# EAGLE design ArduinoInterface_v2 (EAGLE 9.2.1)
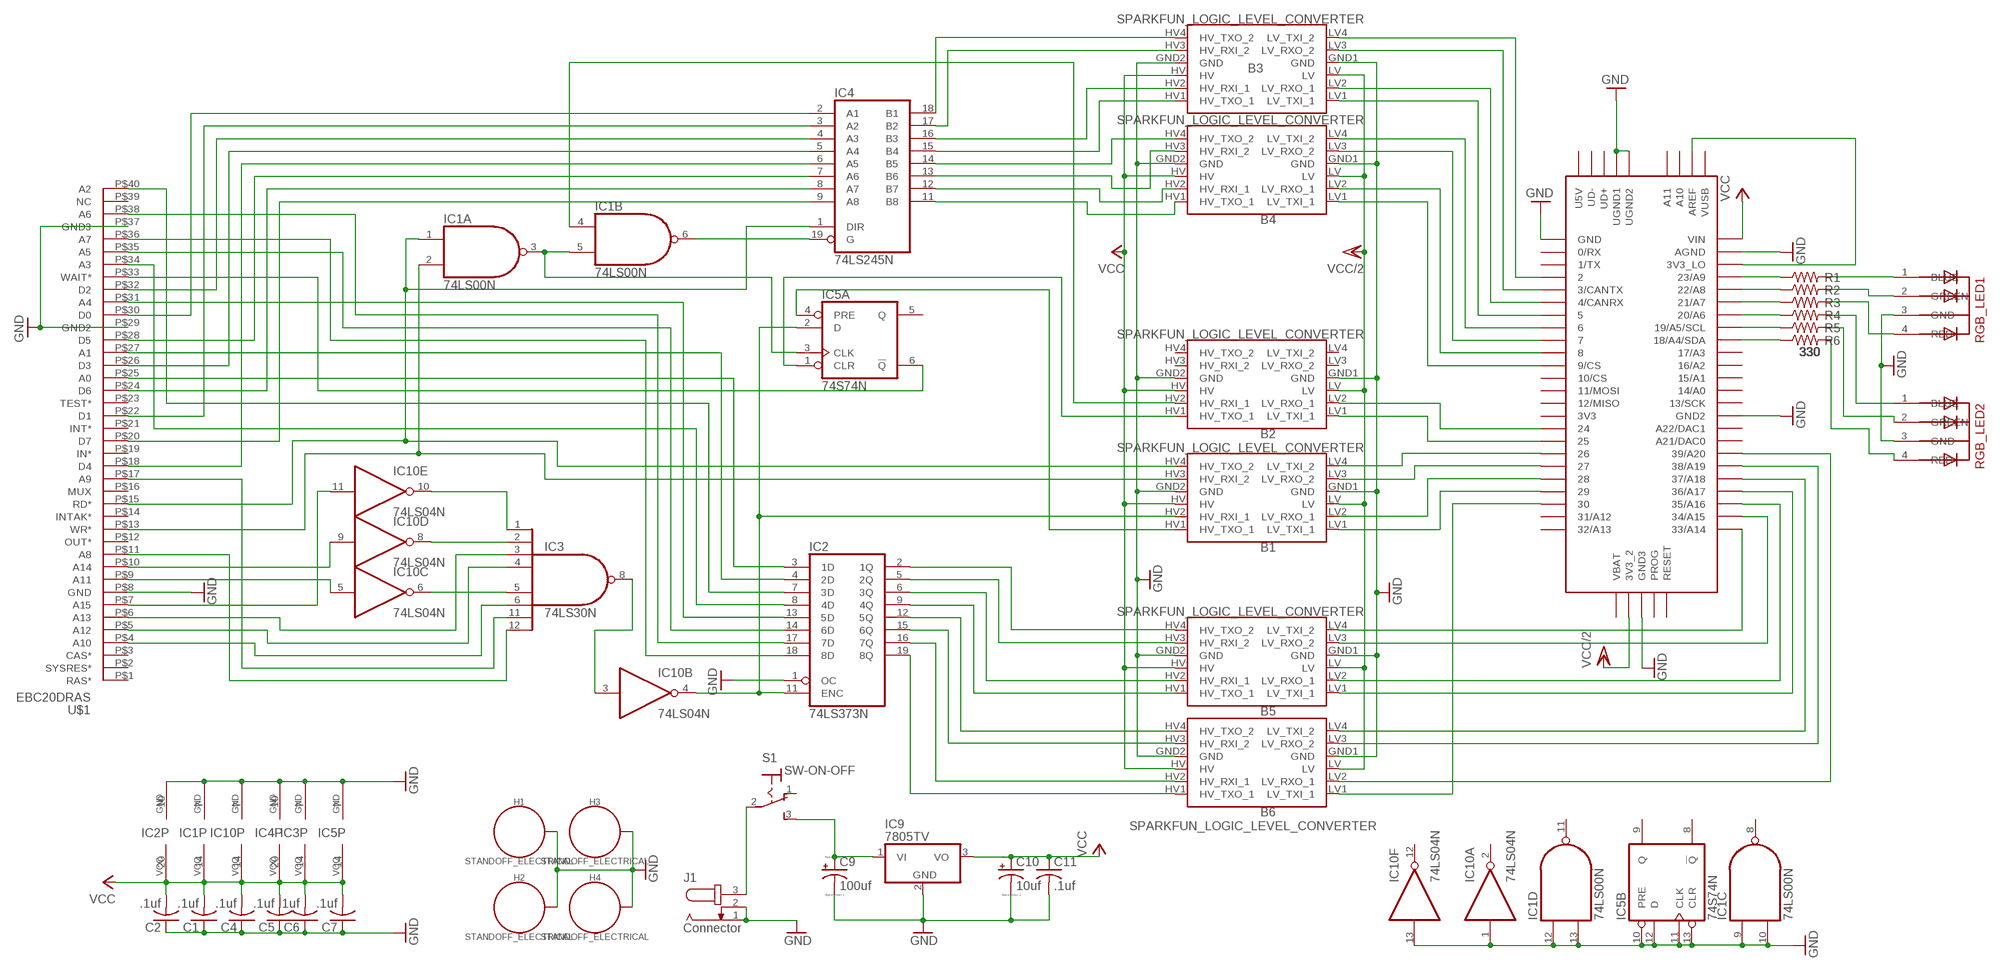
[diagram p0: schematic, sheet 1]

## Parts
B1  SPARKFUN_LOGIC_LEVEL_CONVERTER  [SPARKFUN_LOGIC_LEVEL_CONVERTER]
B2  SPARKFUN_LOGIC_LEVEL_CONVERTER  [SPARKFUN_LOGIC_LEVEL_CONVERTER]
B3  SPARKFUN_LOGIC_LEVEL_CONVERTER  [SPARKFUN_LOGIC_LEVEL_CONVERTER]
B4  SPARKFUN_LOGIC_LEVEL_CONVERTER  [SPARKFUN_LOGIC_LEVEL_CONVERTER]
B5  SPARKFUN_LOGIC_LEVEL_CONVERTER  [SPARKFUN_LOGIC_LEVEL_CONVERTER]
B6  SPARKFUN_LOGIC_LEVEL_CONVERTER  [SPARKFUN_LOGIC_LEVEL_CONVERTER]
C1  .1uf  C-US025-025X050  [C025-025X050]
C2  .1uf  C-US025-025X050  [C025-025X050]
C4  .1uf  C-US025-025X050  [C025-025X050]
C5  .1uf  C-US025-025X050  [C025-025X050]
C6  .1uf  C-US025-025X050  [C025-025X050]
C7  .1uf  C-US025-025X050  [C025-025X050]
C9  100uf  CPOL-USE5-6  [E5-6]
C10  10uf  CPOL-USE5-6  [E5-6]
C11  .1uf  C-US025-025X050  [C025-025X050]
H1  STANDOFF_ELECTRICAL  [STANDOFF-ELECTRICAL]
H2  STANDOFF_ELECTRICAL  [STANDOFF-ELECTRICAL]
H3  STANDOFF_ELECTRICAL  [STANDOFF-ELECTRICAL]
H4  STANDOFF_ELECTRICAL  [STANDOFF-ELECTRICAL]
IC1  74LS00N  [DIL14]
IC2  74LS373N  [DIL20]
IC3  74LS30N  [DIL14]
IC4  74LS245N  [DIL20]
IC5  74S74N  [DIL14]
IC9  7805TV  [TO220V]
IC10  74LS04N  [DIL14]
J1  Connector  JACK-PLUG0  [SPC4077]
R1  330  R-US_0204/2V  [0204V]
R2  330  R-US_0204/2V  [0204V]
R3  330  R-US_0204/2V  [0204V]
R4  330  R-US_0204/2V  [0204V]
R5  330  R-US_0204/2V  [0204V]
R6  330  R-US_0204/2V  [0204V]
RGB_LED1  5MMRGBLED  [LED5MMRGB]
RGB_LED2  5MMRGBLED  [LED5MMRGB]
S1  SW-ON-OFF  M9040P  [M9040P]
U$1  EBC20DRAS  [EBC20DRAS]
U$2  TEENSY_3.5/3.6  [TEENSY_3.5/3.6]

## Nets
A0: IC2.3(1D) U$1.P$25(A0)
A0_AFTER_LATCH: B5.HV4(HV_TXO_2) IC2.2(1Q)
A0_LV: B5.LV4(LV_TXI_2) U$2.33/A14
A1: IC2.4(2D) U$1.P$27(A1)
A1_AFTER_LATCH: B5.HV3(HV_RXI_2) IC2.5(2Q)
A1_LV: B5.LV3(LV_RXO_2) U$2.34/A15
A2: IC2.7(3D) U$1.P$40(A2)
A2_AFTER_LATCH: B5.HV2(HV_RXI_1) IC2.6(3Q)
A2_LV: B5.LV2(LV_RXO_1) U$2.35/A16
A3: IC2.8(4D) U$1.P$34(A3)
A3_AFTER_LATCH: B5.HV1(HV_TXO_1) IC2.9(4Q)
A3_LV: B5.LV1(LV_TXI_1) U$2.36/A17
A4: IC2.13(5D) U$1.P$31(A4)
A4_AFTER_LATCH: B6.HV4(HV_TXO_2) IC2.12(5Q)
A4_LV: B6.LV4(LV_TXI_2) U$2.37/A18
A5: IC2.14(6D) U$1.P$35(A5)
A5_AFTER_LATCH: B6.HV3(HV_RXI_2) IC2.15(6Q)
A5_LV: B6.LV3(LV_RXO_2) U$2.38/A19
A6: IC2.17(7D) U$1.P$38(A6)
A6_AFTER_LATCH: B6.HV2(HV_RXI_1) IC2.16(7Q)
A6_LV: B6.LV2(LV_RXO_1) U$2.39/A20
A7: IC2.18(8D) U$1.P$36(A7)
A7_AFTER_LATCH: B6.HV1(HV_TXO_1) IC2.19(8Q)
A7_LV: B6.LV1(LV_TXI_1) U$2.30
A8: IC3.12(I7) U$1.P$11(A8)
A9: IC3.11(I6) U$1.P$17(A9)
A10: IC3.6(I5) U$1.P$4(A10)
A11: IC10.5(C:I) U$1.P$9(A11)
A12: IC3.4(I3) U$1.P$5(A12)
A13: IC3.3(I2) U$1.P$6(A13)
A15: IC10.11(E:I) U$1.P$7(A15)
D0: IC4.2(A1) U$1.P$30(D0)
D0_HV: B3.HV4(HV_TXO_2) IC4.18(B1)
D0_LV: B3.LV4(LV_TXI_2) U$2.2
D1: IC4.3(A2) U$1.P$22(D1)
D1_HV: B3.HV3(HV_RXI_2) IC4.17(B2)
D1_LV: B3.LV3(LV_RXO_2) U$2.3/CANTX
D2: IC4.4(A3) U$1.P$32(D2)
D2_HV: B3.HV2(HV_RXI_1) IC4.16(B3)
D2_LV: B3.LV2(LV_RXO_1) U$2.4/CANRX
D3: IC4.5(A4) U$1.P$26(D3)
D3_HV: B3.HV1(HV_TXO_1) IC4.15(B4)
D3_LV: B3.LV1(LV_TXI_1) U$2.5
D4: IC4.6(A5) U$1.P$18(D4)
D4_HV: B4.HV4(HV_TXO_2) IC4.14(B5)
D4_LV: B4.LV4(LV_TXI_2) U$2.6
D5: IC4.7(A6) U$1.P$28(D5)
D5_HV: B4.HV3(HV_RXI_2) IC4.13(B6)
D5_LV: B4.LV3(LV_RXO_2) U$2.7
D6: IC4.8(A7) U$1.P$24(D6)
D6_HV: B4.HV2(HV_RXI_1) IC4.12(B7)
D6_LV: B4.LV2(LV_RXO_1) U$2.8
D7: IC4.9(A8) U$1.P$20(D7)
D7_HV: B4.HV1(HV_TXO_1) IC4.11(B8)
D7_LV: B4.LV1(LV_TXI_1) U$2.9/CS
DATA_BUS_ENABLE: B2.HV2(HV_RXI_1) IC1.4(B:I0)
DATA_BUS_ENABLE_LV: B2.LV2(LV_RXO_1) U$2.24
FLIPFLOP_CLR: B2.HV1(HV_TXO_1) IC5.1(A:CLR)
FLIPFLOP_CLR_LV: B2.LV1(LV_TXI_1) U$2.25
FLIPFLOP_PRE: B1.HV1(HV_TXO_1) IC5.4(A:PRE)
FLIPFLOP_PRE_LV: B1.LV1(LV_TXI_1) U$2.29
GND: B1.GND1(GND) B1.GND2(GND) B2.GND1(GND) B2.GND2(GND) B3.GND1(GND) B3.GND2(GND) B4.GND1(GND) B4.GND2(GND) B5.GND1(GND) B5.GND2(GND) B6.GND1(GND) B6.GND2(GND) C1.1 C2.1 C4.1 C5.1 C6.1 C7.1 C9.- C10.- C11.2 H1.P1 H2.P1 H3.P1 H4.P1 IC1.7(P:GND) IC1.9(C:I0) IC1.10(C:I1) IC1.12(D:I0) IC1.13(D:I1) IC2.1(OC) IC2.10(GND) IC3.7(GND) IC4.10(GND) IC5.7(P:GND) IC5.10(B:PRE) IC5.11(B:CLK) IC5.12(B:D) IC5.13(B:CLR) IC9.2(GND) IC10.1(A:I) IC10.7(P:GND) IC10.13(F:I) J1.1 J1.2 RGB_LED1.3(GND) RGB_LED2.3(GND) U$1.P$8(GND) U$1.P$29(GND2) U$1.P$37(GND3) U$2.AGND U$2.GND U$2.GND2 U$2.GND3 U$2.UGND1 U$2.UGND2
INTERRUPT: B1.HV2(HV_RXI_1) IC2.11(ENC) IC5.2(A:D) IC10.4(B:O)
INTERRUPT_LV: B1.LV2(LV_RXO_1) U$2.28
N$1: U$2.3V3_LO U$2.AREF
N$2: IC10.9(D:I) U$1.P$10(A14)
N$3: IC3.1(I0) IC10.10(E:O)
N$4: IC3.2(I1) IC10.8(D:O)
N$5: R1.1 U$2.23/A9
N$6: R2.1 U$2.22/A8
N$7: IC3.8(O) IC10.3(B:I)
N$8: IC3.5(I4) IC10.6(C:O)
N$9: R3.1 U$2.21/A7
N$10: R1.2 RGB_LED1.1(BLUE)
N$11: IC1.6(B:O) IC4.19(G)
N$12: C9.+ IC9.1(VI) S1.3(S)
N$13: IC1.3(A:O) IC1.5(B:I1) IC5.3(A:CLK)
N$14: R2.2 RGB_LED1.2(GREEN)
N$15: R3.2 RGB_LED1.4(RED)
N$16: R4.1 U$2.20/A6
N$17: R5.1 U$2.19/A5/SCL
N$18: R6.1 U$2.18/A4/SDA
N$19: R4.2 RGB_LED2.1(BLUE)
N$20: R5.2 RGB_LED2.2(GREEN)
N$21: R6.2 RGB_LED2.4(RED)
N$22: J1.3 S1.2(P)
RD_: B1.HV4(HV_TXO_2) IC1.1(A:I0) IC4.1(DIR) U$1.P$15(RD*)
RD_LV_: B1.LV4(LV_TXI_2) U$2.26
VCC: B1.HV B2.HV B3.HV B4.HV B5.HV B6.HV C1.2 C2.2 C4.2 C5.2 C6.2 C7.2 C10.+ C11.1 IC1.14(P:VCC) IC2.20(VCC) IC3.14(VCC) IC4.20(VCC) IC5.14(P:VCC) IC9.3(VO) IC10.14(P:VCC) U$2.VIN
VCC/2: B1.LV B2.LV B3.LV B4.LV B5.LV B6.LV U$2.3V3_2
WAIT_: IC5.6(A:!Q) U$1.P$33(WAIT*)
WR_: B1.HV3(HV_RXI_2) IC1.2(A:I1) U$1.P$13(WR*)
WR_LV_: B1.LV3(LV_RXO_2) U$2.27
Unconnected: B2.HV3(HV_RXI_2) B2.HV4(HV_TXO_2) B2.LV3(LV_RXO_2) B2.LV4(LV_TXI_2) IC1.8(C:O) IC1.11(D:O) IC5.5(A:Q) IC5.8(B:!Q) IC5.9(B:Q) IC10.2(A:O) IC10.12(F:O) S1.1(O) U$1.P$1(RAS*) U$1.P$2(SYSRES*) U$1.P$3(CAS*) U$1.P$12(OUT*) U$1.P$14(INTAK*) U$1.P$16(MUX) U$1.P$19(IN*) U$1.P$21(INT*) U$1.P$23(TEST*) U$1.P$39(NC) U$2.0/RX U$2.1/TX U$2.3V3 U$2.10/CS U$2.11/MOSI U$2.12/MISO U$2.13/SCK U$2.14/A0 U$2.15/A1 U$2.16/A2 U$2.17/A3 U$2.21/DAC0(A21/DAC0) U$2.31/A12 U$2.32/A13 U$2.A10 U$2.A11 U$2.A22/DAC1 U$2.PROG U$2.RESET U$2.U5V U$2.UD+ U$2.UD- U$2.VBAT U$2.VUSB

## Library data of the parts
B1-B6 = SparkFun-Boards:SPARKFUN_LOGIC_LEVEL_CONVERTER: SparkFun Logic Level Converter -Bi-Directional This is the mechnical outline for the 3.3V - 5V bi directional logic level converter. *Note, the "LOCK" Package has the header pins staggered by an offset of 5 mils (off center line), so that when you slide a row of standard 0.1" headers into the PTH pads, it will hold position vertically. See the follwing turorial for more information on this type of special footprints: Sneaky Footprints <https://www.sparkfun.com/tutorials/114> SparkFun Products: SparkFun Logic Level Converter - Bi-Directional <https://www.sparkfun.com/products/12009>
C1 C2 C4-C7 C11 = adafruit:C-US: CAPACITOR, American symbol
C9 C10 = resistor:CPOL-US: POLARIZED CAPACITOR, American symbol
H1-H4 = SparkFun-Hardware:STANDOFF_ELECTRICAL: Stand Off Drill holes with an electrical connection. For example, use these to ground your board to a chassis. Example SparkFun Products Screw - Phillips Head (1/4", 4-40, 10 pack) <https://www.sparkfun.com/products/10453> (PRT-10453) Screw - Phillips Head (1/2", 4-40, 10 pack) <https://www.sparkfun.com/products/10452> (PRT-10452) Screw - Phillips Head (3/4", 4-40, 10 pack) <https://www.sparkfun.com/products/10451> (PRT-10451) Screw - Phillips Head (1", 4-40, 10 pack) <https://www.sparkfun.com/products/10450> (PRT-10450)
IC1 = 74xx-us:74*00: Quad 2-input NAND gate
IC2 = 74xx-us:74*373: Octal D type transparent LATCH, edge triggered
IC3 = 74xx-us:74*30: 8-input NAND gate
IC4 = 74xx-us:74*245: Octal BUS TRANSCEIVER, 3-state
IC5 = 74xx-us:74*74: Dual D type positive edge triggered FLIP FLOP, preset and clear
IC9 = linear:78*: Positive VOLTAGE REGULATOR Source: http://cache.national.com/ds/LM/LM78L05.pdf http://www.fairchildsemi.com/ds/LM/LM7805.pdf
IC10 = 74xx-us:74*04: Hex INVERTER
J1 = con-jack:JACK-PLUG: DC POWER JACK Power Jack, DC, Right Angle, Through Hole, Rated 5A at 16VDC, PC Terminals Distributor: Farnell (www.Farnell.de) Drawing: 84N1161.pdf / 84N1162.pdf Manufacturer: SPC Technology (www.spctechnology.com) Type: SPC4077 / SPC 4078; OC_FARNELL: unknown; OC_NEWARK: unknown
R1-R6 = resistor:R-US_: RESISTOR, American symbol
RGB_LED1 RGB_LED2 = adafruit:5MMRGBLED
S1 = switch:M9040P: TOGGLE SWITCH Marquardt
U$1 = TMS99:EBC20DRAS
U$2 = Teensy356:TEENSY_3.5/3.6

## Net classes
0 default: width 0.3 mm, clearance 0.05 mm

## Board
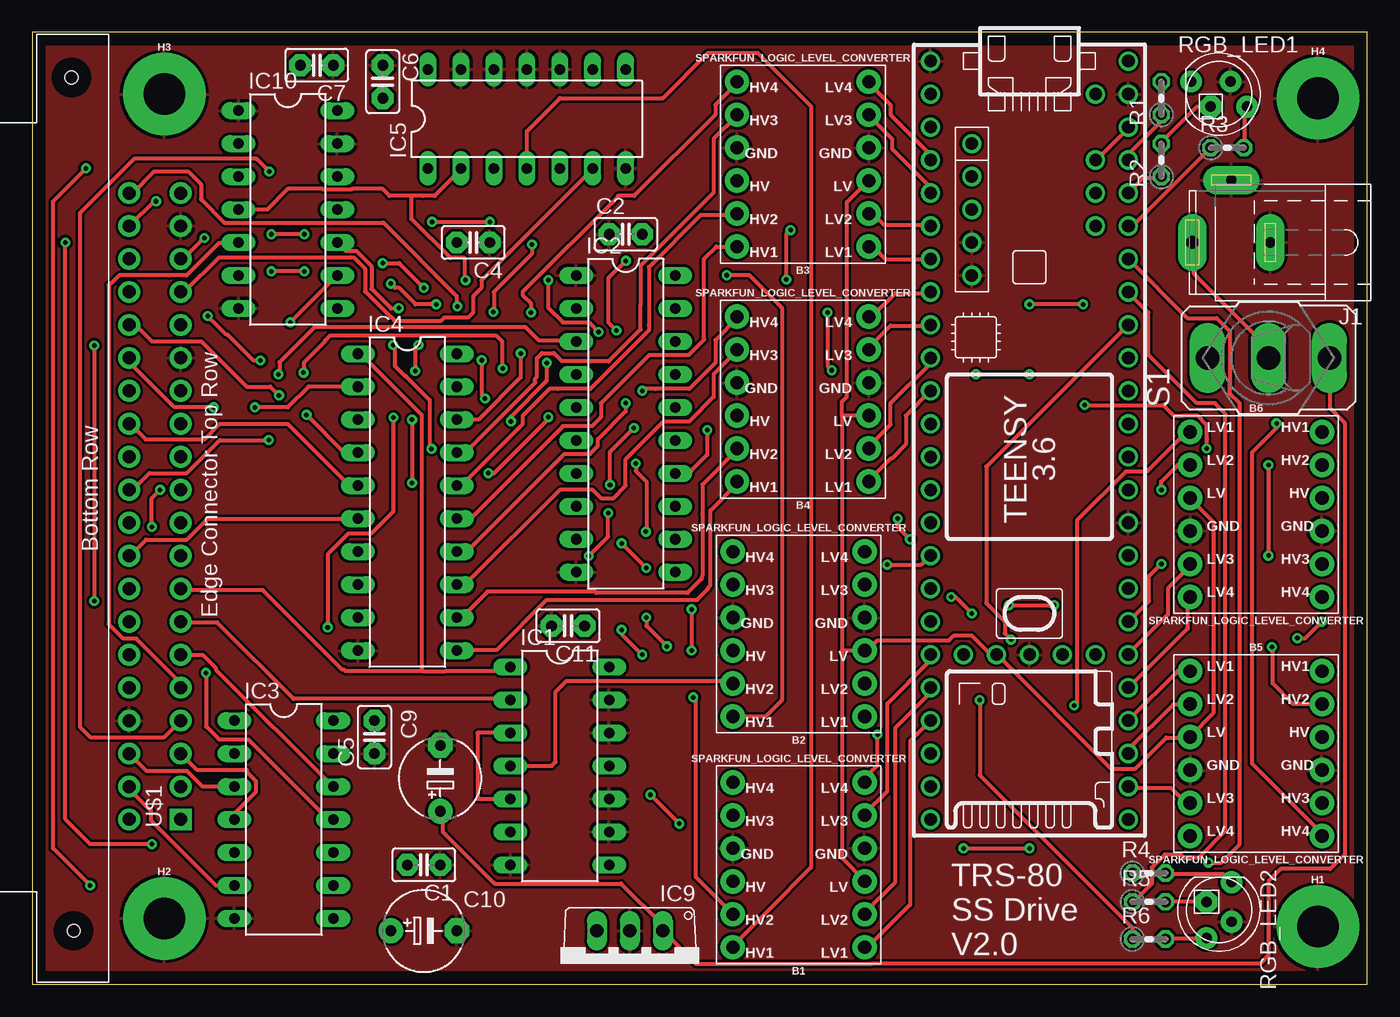
[diagram p1: board, top side]
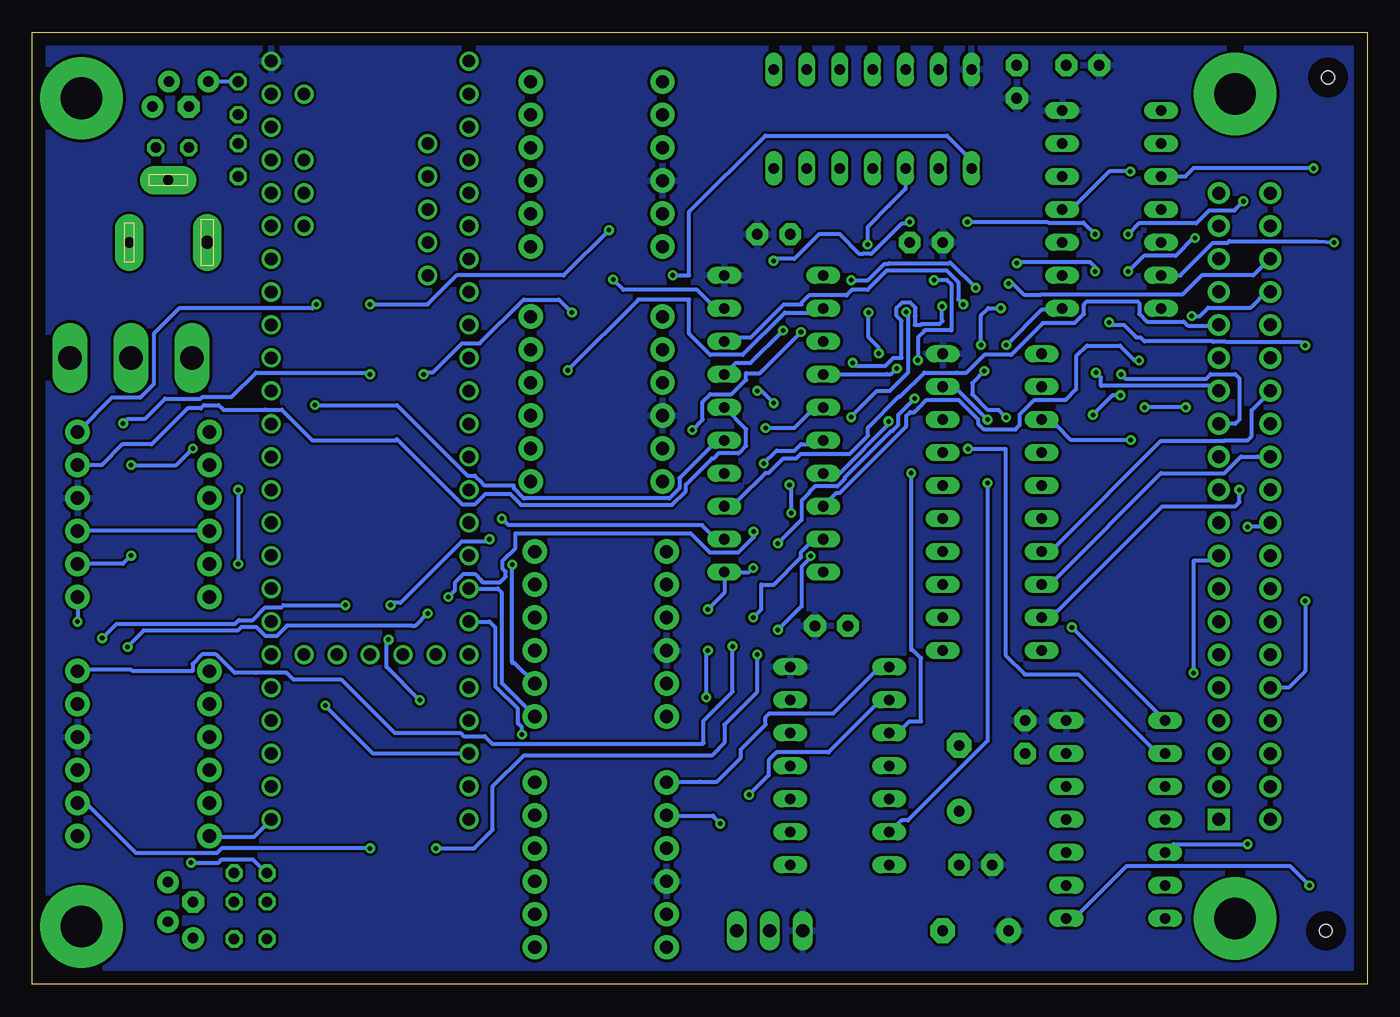
[diagram p2: board, bottom side, seen from below]

Size 102.85 x 73.33 mm. Coordinates in mm from the lower left corner, seen from the top.
Outline: 0,0 102.85,0 102.85,73.33 0,73.33 0,0
Copper layers (1*16): Top 0.035mm / dielectric 1.5mm / Bottom 0.035mm
Design rules "default": minimum track width 0.2mm, minimum drill 0.35mm, track to track 8mil, track to pad 8mil, pad to pad 8mil, via to via 8mil, smd to smd 8mil, copper to edge 40mil, drill to drill 6mil, minimum pad ring 10mil, minimum via ring 8mil, stop-mask expansion 4mil, vias tented up to drill 0mil, thermal gap 10mil

### Footprints (pad centres in the part's own frame; a part is rotated, then mirrored left to right if it is on the bottom)
SPARKFUN_LOGIC_LEVEL_CONVERTER = drill 1.016 pad 1.88: GND1 -5.08,-1.27; GND2 5.08,-1.27; HV 5.08,1.27; HV1 5.08,6.35; HV2 5.08,3.81; HV3 5.08,-3.81; HV4 5.08,-6.35; LV -5.08,1.27; LV1 -5.08,6.35; LV2 -5.08,3.81; LV3 -5.08,-3.81; LV4 -5.08,-6.35
C025-025X050 = drill 0.813 pad 1.676 octagon: 1 -1.27,0; 2 1.27,0
E5-6 = drill 0.813 pad 1.905: + -2.54,0 | drill 0.813 pad 1.905 octagon: - 2.54,0
STANDOFF-ELECTRICAL = drill 3.2 pad 6.35: P1 0,0
DIL14 = drill 0.813 long: 1 -7.62,-3.81; 2 -5.08,-3.81; 3 -2.54,-3.81; 4 0,-3.81; 5 2.54,-3.81; 6 5.08,-3.81; 7 7.62,-3.81; 8 7.62,3.81; 9 5.08,3.81; 10 2.54,3.81; 11 0,3.81; 12 -2.54,3.81; 13 -5.08,3.81; 14 -7.62,3.81
DIL20 = drill 0.813 long: 1 -11.43,-3.81; 2 -8.89,-3.81; 3 -6.35,-3.81; 4 -3.81,-3.81; 5 -1.27,-3.81; 6 1.27,-3.81; 7 3.81,-3.81; 8 6.35,-3.81; 9 8.89,-3.81; 10 11.43,-3.81; 11 11.43,3.81; 12 8.89,3.81; 13 6.35,3.81; 14 3.81,3.81; 15 1.27,3.81; 16 -1.27,3.81; 17 -3.81,3.81; 18 -6.35,3.81; 19 -8.89,3.81; 20 -11.43,3.81
TO220V = drill 1.016 long: 1 -2.54,-2.54; 2 0,-2.54; 3 2.54,-2.54
SPC4077 = drill 0.8 pad 2.184 long: 1 -3,0; 2 0,-4.8 | drill 1 pad 2.184 long: 3 3,0
0204V = drill 0.813 octagon: 1 -1.27,0; 2 1.27,0
LED5MMRGB = drill 0.8 pad 1.676: 1 -2.159,0.968; 3 0.889,0.968; 4 2.159,-0.968 | drill 0.8 pad 1.676 octagon: 2 -0.635,-0.968
M9040P = drill 1.803 long: 1 0,4.699; 2 0,0; 3 0,-4.699
EBC20DRAS = drill 1 pad 1.676 square: P$1 0,0 | drill 1 pad 1.676: P$2 0,3.969; P$3 2.54,0; P$4 2.54,3.969; P$5 5.08,0; P$6 5.08,3.969; P$7 7.62,0; P$8 7.62,3.969; P$9 10.16,0; P$10 10.16,3.969; P$11 12.7,0; P$12 12.7,3.969; P$13 15.24,0; P$14 15.24,3.969; P$15 17.78,0; P$16 17.78,3.969; P$17 20.32,0; P$18 20.32,3.969; P$19 22.86,0; P$20 22.86,3.969; P$21 25.4,0; P$22 25.4,3.969; P$23 27.94,0; P$24 27.94,3.969; P$25 30.48,0; P$26 30.48,3.969; P$27 33.02,0; P$28 33.02,3.969; P$29 35.56,0; P$30 35.56,3.969; P$31 38.1,0; P$32 38.1,3.969; P$33 40.64,0; P$34 40.64,3.969; P$35 43.18,0; P$36 43.18,3.969; P$37 45.72,0; P$38 45.72,3.969; P$39 48.26,0; P$40 48.26,3.969 | hole 1: -8.572,8.255; 57.15,8.414
TEENSY_3.5/3.6 = drill 0.965: 0/RX -25.4,-7.62; 1/TX -22.86,-7.62; 2 -20.32,-7.62; 3/CANTX -17.78,-7.62; 3V3 7.62,-7.62; 3V3_2 17.78,-2.54; 3V3_LO -22.86,7.62; 4/CANRX -15.24,-7.62; 5 -12.7,-7.62; 6 -10.16,-7.62; 7 -7.62,-7.62; 8 -5.08,-7.62; 9/CS -2.54,-7.62; 10/CS 0,-7.62; 11/MOSI 2.54,-7.62; 12/MISO 5.08,-7.62; 13/SCK 5.08,7.62; 14/A0 2.54,7.62; 15/A1 0,7.62; 16/A2 -2.54,7.62; 17/A3 -5.08,7.62; 18/A4/SDA -7.62,7.62; 19/A5/SCL -10.16,7.62; 20/A6 -12.7,7.62; 21/A7 -15.24,7.62; 21/DAC0 12.7,7.62; 22/A8 -17.78,7.62; 23/A9 -20.32,7.62; 24 10.16,-7.62; 25 12.7,-7.62; 26 15.24,-7.62; 27 17.78,-7.62; 28 20.32,-7.62; 29 22.86,-7.62; 30 25.4,-7.62; 31/A12 27.94,-7.62; 32/A13 30.48,-7.62; 33/A14 30.48,7.62; 34/A15 27.94,7.62; 35/A16 25.4,7.62; 36/A17 22.86,7.62; 37/A18 20.32,7.62; 38/A19 17.78,7.62; 39/A20 15.24,7.62; A10 -17.78,5.08; A11 -15.24,5.08; A22/DAC1 10.16,7.62; AGND -25.4,7.62; AREF -20.32,5.08; GND -27.94,-7.62; GND2 7.62,7.62; GND3 17.78,0; PROG 17.78,2.54; RESET 17.78,5.08; U5V -21.59,-4.445; UD+ -16.51,-4.445; UD- -19.05,-4.445; UGND1 -13.97,-4.445; UGND2 -11.43,-4.445; VBAT 17.78,-5.08; VIN -27.94,7.62; VUSB -25.4,5.08

### Placement (x,y rotation side)
B1  59.05,9.21 180 top
B2  59.05,26.99 180 top
B3  59.37,63.18 180 top
B4  59.37,45.09 180 top
B5  94.3,17.78 0 top
B6  94.3,36.2 0 top
C1  30.16,9.21 180 top
C2  45.72,57.78 0 top
C4  33.97,57.15 180 top
C5  26.35,19.05 90 top
C6  26.99,69.53 270 top
C7  21.91,70.8 180 top
C9  31.43,15.88 90 top
C10  30.16,4.13 0 top
C11  41.27,27.62 180 top
H1  99.06,4.45 0 top
H2  10.16,5.08 0 top
H3  10.16,68.58 0 top
H4  99.06,68.26 0 top
IC1  40.64,16.83 270 top
IC2  45.72,43.18 270 top
IC3  19.37,12.7 270 top
IC4  28.89,37.15 270 top
IC5  38.1,66.67 0 top
IC9  46.04,1.59 180 top
IC10  19.68,59.69 270 top
J1  92.39,57.15 180 top
R1  87,68.26 90 top
R2  87,63.5 90 top
R3  92.08,64.45 0 top
R4  86.04,8.57 0 top
R5  86.04,6.35 0 top
R6  86.04,3.49 0 top
RGB_LED1  91.44,68.58 0 top
RGB_LED2  91.44,5.71 270 top
S1  95.25,48.26 90 top
U$1  11.43,12.7 90 top
U$2  76.83,43.18 270 top

### Tracks (layer width: path | path; a pad name or v marks a point on that pad's centre or on a via)
A0  (via drill 0.35)
  Top 0.3: 38,50.62 39,49.62 41.88,49.62 IC2.3
  Top 0.305: 38,50.62 21.73,50.62 19.05,47.94 19.05,47.09 v18.95,46.99
  Bottom 0.3: v18.95,46.99 18.58,46.61 12.44,46.61 12.05,47 10.17,47 9.84,46.67 9.84,43.5 10.16,43.18 U$1.P$25
A0_AFTER_LATCH  (via drill 0.35)
  Top 0.3: 94.06,16.94 99.5,11.5 B5.HV4 | v72.71,46.99 v76.83,46.99
  Top 0.305: v61.28,51.75 61.28,47.62 v61.59,47.31 | v95.86,43.22 95.86,42.84 93.98,40.96 93.98,17.02 94.06,16.94
  Bottom 0.3: 52.25,52.75 52.25,50.12 50.62,48.5 48.12,48.5 44.88,51.75 42.25,51.75 42,52 IC2.2 | 65,52.75 68.38,49.38 69.75,49.38 72,47.12 72.57,47.12 v72.71,46.99 | 89.88,45.12 89.75,45.25 87.5,45.25 85.62,47.12 76.97,47.12 v76.83,46.99
  Bottom 0.305: 52.25,52.75 56.15,52.75 v61.59,47.31 | 65,52.75 62.27,52.75 v61.28,51.75 | 89.88,45.12 92.63,45.12 94.22,43.54 95.54,43.54 v95.86,43.22
A0_LV
  Bottom 0.3: U$2.33/A14 84.5,12.62 85.75,11.38 89.12,11.38 B5.LV4
A1  (via drill 0.35)
  Top 0.3: 22.96,50 33.97,50
  Top 0.305: v20.89,47.12 20.95,47.19 20.95,47.94 22.54,49.53 22.54,49.58 22.96,50 | v36.24,47.44 36.2,47.49 36.2,49.53 35.73,50 33.97,50
  Bottom 0.3: 37,47 41.88,47 IC2.4 | U$1.P$27 11.6,45.72 11.98,46.11
  Bottom 0.305: 11.98,46.11 20.51,46.11 20.51,46.74 v20.89,47.12 | 37,47 36.68,47 v36.24,47.44
A1_AFTER_LATCH  (via drill 0.35)
  Top 0.3: v44.38,36.31 44.38,34.5 v42.88,33 | v44.51,38.48 44.51,41.02 v46.35,42.86
  Top 0.305: v45.4,27.3 45.4,26.99 v46.99,25.4 | v71.75,10.48 v76.83,10.48
  Bottom 0.3: 50.5,17.62 65,17.62 67.38,15.25 | 88.38,10.38 88.62,10.12 94.88,10.12 98.62,13.88 99.38,13.88 B5.HV3 | v46.35,42.86 44.13,42.86 42.55,44.45 IC2.5
  Bottom 0.305: v42.88,33 42.88,32.88 43.59,32.17 43.59,29.12 v45.4,27.3 | 50.5,17.62 49.53,18.59 49.53,20 46.99,22.54 v46.99,25.4 | 67.38,15.25 67.38,11.91 68.81,10.48 v71.75,10.48 | v44.38,36.31 44.38,38.34 v44.51,38.48 | v76.83,10.48 88.27,10.48 88.38,10.38
A1_LV
  Top 0.3: U$2.34/A15 84.5,15.12 87.75,15.12 88.88,14 89.12,14 B5.LV3
A2  (via drill 0.35)
  Top 0.3: v36.88,43.38 36.88,43.74 39.63,46.5 v39.63,47.88 | 13,61.62 12,62.62 9.38,62.62 7.75,61 7.5,61 U$1.P$40
  Top 0.305: 13,61.62 13,60.47 14.79,58.67 27.05,58.67 32.7,53.02 32.7,52.28 v32.75,52.23
  Bottom 0.3: 41.88,39.38 IC2.7 | v32.75,52.23 32.75,51.16 32.7,51.12 32.94,50.88 34.33,50.88 34.41,50.8 34.84,50.8 34.84,51.44 34.79,51.49 34.79,52.1 35.22,52.53 | 36.83,47.94 36.51,48.26 35.88,48.26 35.88,51.12 36.25,51.49 36.25,52.1 35.99,52.37
  Bottom 0.305: v36.88,43.38 36.88,43.13 40.64,39.37 41.87,39.37 41.88,39.38 | 36.83,47.94 37.15,47.62 39.38,47.62 v39.63,47.88 | 35.22,52.53 35.82,52.53 35.99,52.37
A2_AFTER_LATCH  (via drill 0.35)
  Top 0.305: v70.8,29.84 71.12,29.84 v72.39,28.57 | v46.5,40.12 46.5,39.54 47.31,38.73 47.31,34.9 v47.28,34.87 | B5.HV2 97.16,21.59 95.57,23.18 95.57,25.94 v95.52,25.99
  Bottom 0.3: v46.5,40.12 45.5,41.12 44.12,41.12 43.62,41.62 42.25,41.62 42,41.88 IC2.6 | 48.47,33.25 50.62,33.25 52.12,34.75 65.62,34.75 65.62,33.61 66.61,32.63 66.61,32.03 66.38,31.8 66.38,31.41 66.8,30.99 68.18,30.99 68.26,31.07 68.26,31.14 68.75,31.62 | 73.62,27.62 82.25,27.62
  Bottom 0.305: v70.8,29.84 70.31,30.34 70.31,30.93 69.61,31.62 68.75,31.62 | 73.62,27.62 73.34,27.62 v72.39,28.57 | v47.28,34.87 47.28,34.44 48.47,33.25 | 82.25,27.62 83.22,27.62 84,26.85 84.91,26.85 85.6,27.54 86.74,27.54 87.04,27.24 94.3,27.24 94.3,27.21 v95.52,25.99
A2_LV
  Top 0.305: U$2.35/A16 84.45,18.1 87.95,21.59 B5.LV2
A3  (via drill 0.35)
  Top 0.305: v17.57,48.06 17.04,48.06 15.04,50.05 14.94,50.05 v13.51,51.48
  Bottom 0.3: 12.25,52.12 8.97,52.12 7.72,53.38 7.5,53.38 U$1.P$34 | 23.18,45.09 23.24,45.02 25.65,45.02 26.76,43.92 26.76,43.09 27.1,42.75 29.53,42.75 29.55,42.77 29.98,43.2 29.98,43.52 31.49,45.02 33.94,45.02 34.57,44.39 34.58,44.39 34.88,44.09 35.2,44.09 35.5,43.79 35.5,42.98 40.62,37.85 40.89,37.85 IC2.8
  Bottom 0.305: v17.57,48.06 17.89,48.06 19.04,49.21 21.59,49.21 22.43,48.38 22.43,45.84 23.18,45.09 | v13.51,51.48 12.89,51.48 12.25,52.12
A3_AFTER_LATCH  (via drill 0.35)
  Top 0.305: v47.31,28.26 47.31,27.62 v48.9,26.04
  Bottom 0.3: 51.22,18.5 67.38,18.5 68,19.12 69.62,19.12 | 82.75,23.5 83.25,24 85.62,24 | 95.25,24.25 99.38,24.25 B5.HV1 | v47.31,28.26 46.67,28.89 46.67,30.8 45.72,30.8 43.61,32.91 43.61,33.3 42.86,34.05 42.86,34.29 IC2.9
  Bottom 0.305: 51.22,18.5 51.12,18.6 51.12,20.32 48.9,22.54 v48.9,26.04 | 85.62,24 87.26,24 88.68,25.43 89.75,25.43 90.51,24.67 90.51,24.13 95.13,24.13 95.25,24.25 | 82.75,23.5 79.06,23.5 74.93,19.37 69.87,19.37 69.62,19.12
A3_LV
  Top 0.3: U$2.36/A17 84.5,20.38 88.25,24.12 89.12,24.12 B5.LV1
A4
  Bottom 0.3: 40.75,40.88 43.62,40.88 44,40.5 45,40.5 46.12,39.38 46.38,39.38 48.5,37.25 49.12,37.25 49.5,36.88 IC2.13 | 38.4,42.97 36.12,45.25 36,45.25 34.12,47.12 31.62,47.12 | 29.5,48.5 27.42,48.5 24.99,50.93 22.54,50.93 21.82,51.65 21.82,52.39 21.59,52.62 17.7,52.62 17.55,52.47 17.55,51.65 16.95,51.06 14.12,51.06 13.81,50.75 11.48,50.75 U$1.P$31
  Bottom 0.305: 31.62,47.12 30.88,47.12 29.5,48.5 | 40.75,40.88 39.85,40.88 38.46,42.27 38.46,42.92 38.4,42.97
A4_AFTER_LATCH  (via drill 0.35)
  Top 0.3: v67.63,34.29 66.67,35.24 v66.67,35.88
  Top 0.305: v97.47,26.67 98.11,26.67 v99.38,27.94 | v75.25,29.21 v78.74,29.21
  Bottom 0.3: 74.38,29.49 69.75,34.12 67.79,34.12 v67.63,34.29 | IC2.12 49.62,34.38 50,34.75 50.62,34.75 51.25,35.38 66.17,35.38 v66.67,35.88
  Bottom 0.305: v97.47,26.67 96.39,27.75 87.25,27.75 86.95,28.05 85.89,28.05 84.91,29.03 83.68,29.03 83.5,29.21 v78.74,29.21 | B6.HV4 v99.38,27.94 | v75.25,29.21 75.06,29.39 74.48,29.39 74.38,29.49
A4_LV
  Top 0.3: U$2.37/A18 84.5,22.88 89,27.38 89,29.62 89.12,29.75 B6.LV4
A5  (via drill 0.35)
  Top 0.3: v52,42.7 52,40.8 50.8,39.6 49.76,39.6 IC2.14 | v43.62,50.25 42.88,51 40.88,51 39.75,52.12 v39.75,54.25 | v13.25,57.5 11.75,56 11.5,56 U$1.P$35
  Top 0.305: v26.99,55.56 28.26,55.56 v30.16,53.66 | v20.95,54.93 v18.41,54.93
  Bottom 0.3: 14.75,56.12 13.38,57.5 v13.25,57.5 | 50.61,45.47 48.96,45.47 47.86,46.57 47.86,47.08 46.8,47.08 v43.62,50.25
  Bottom 0.305: v26.99,55.56 26.92,55.63 22.41,55.63 22.41,55.62 21.34,55.62 20.95,55.24 v20.95,54.93 | v30.16,53.66 32.13,55.62 32.19,55.56 36.83,55.56 36.88,55.51 37.21,55.51 38.47,54.25 v39.75,54.25 | 50.61,45.47 51.21,44.87 51.21,43.5 v52,42.7 | 14.75,56.12 17.22,56.12 v18.41,54.93
A5_AFTER_LATCH  (via drill 0.35)
  Top 0.305: v95.25,40.01 v95.25,33.02 | v81.08,44.62 87.14,44.62 87.95,43.81 88.66,43.81 88.68,43.84 89.75,43.84 90.51,43.08 90.51,42.01 90.49,41.98 v90.49,41.27
  Bottom 0.3: 69.62,39.5 74.75,44.62 v81.08,44.62 | IC2.15 49.62,41.88 50,41.5 50.5,41.5 53,39 53,38.2 53.76,37.44 64.99,37.44 65.75,38.2 65.75,38.42 67.99,38.42 68.12,38.55
  Bottom 0.305: v90.49,41.27 91.76,40.01 v95.25,40.01 | v95.25,33.02 95.89,32.38 B6.HV3 | 68.12,38.55 68.76,39.19 69.32,39.19 69.62,39.5
A5_LV
  Top 0.3: U$2.38/A19 84.5,25.5 87.5,28.5 87.5,30.5 89.12,32.12 89.12,32.38 B6.LV3
A6  (via drill 0.35)
  Top 0.3: 44.38,51.32 44.38,51 v45.01,50.37
  Top 0.305: v30.8,58.74 v35.24,58.74 | v20.95,57.78 v18.41,57.78 | v9.53,60.33 9.37,60.33 U$1.P$38 | 44.38,51.32 44.38,54.38 v45.73,55.74
  Bottom 0.3: 48,47.88 48.62,47.88 49.5,47 IC2.17 | 13.16,58.62 12.16,59.62 | 47.82,47.88 47.5,47.88 v45.01,50.37
  Bottom 0.305: v35.24,58.74 35.35,58.62 35.84,58.62 38.2,56.27 38.86,56.27 38.88,56.25 39.1,56.25 40.64,57.78 42.23,57.78 44.13,55.88 45.59,55.88 v45.73,55.74 | v30.8,58.74 24.64,58.74 24.58,58.67 21.84,58.67 v20.95,57.78 | 48,47.88 47.82,47.88 | 13.16,58.62 17.57,58.62 v18.41,57.78 | 12.16,59.62 10.22,59.62 v9.53,60.33
A6_AFTER_LATCH
  Bottom 0.3: 89.88,44.38 89.62,44.62 88.5,44.62 88.12,44.25 84.93,44.25 84.91,44.27 83.64,44.27 81.28,41.91 74.84,41.91 74.75,42 69.75,37 68.73,37 67.94,37.78 66.04,37.78 65.2,36.94 53.55,36.94 52.5,37.99 52.5,38.5 50.5,40.5 50.38,40.5 49.98,40.9 48.45,40.9 48.38,40.97 | IC2.16
  Bottom 0.305: 48.38,40.97 47.85,41.49 47.85,42.77 IC2.16 | B6.HV2 97.51,40.01 95.92,41.59 93.66,41.59 90.88,44.38 89.88,44.38
A6_LV  (via drill 0.35)
  Top 0.305: U$2.39/A20 86.04,29.53 86.04,31.43 v87,32.38 | v87,38.1 87,38.73 88.27,40.01 B6.LV2
  Bottom 0.305: v87,38.1 v87,32.38
A7  (via drill 0.35)
  Top 0.305: v31.11,52.39 29.53,52.39 28.26,53.66 27.94,53.66 v27.62,53.98
  Bottom 0.3: 37,55 38.5,53.5 39.69,53.5 40.1,53.08 42.99,53.08 43.58,52.49 43.58,52.39 44.95,52.39 47.49,49.85 49.21,49.85 IC2.18 | 25.12,53.12 14.25,53.12 12.75,54.62 8.78,54.62 7.48,55.93 U$1.P$36
  Bottom 0.305: v31.11,52.39 31.49,52.77 31.49,54.08 32.41,55 37,55 | 25.12,53.12 26.45,53.12 27.3,53.98 v27.62,53.98
A7_AFTER_LATCH  (via drill 0.35)
  Top 0.305: v80.96,52.39 v76.83,52.39 | v58.1,54.29 58.1,57.78 v58.42,58.1
  Bottom 0.3: 51.62,53.5 50.62,52.5 50,52.5 49.62,52.12 IC2.19 | 91.61,52.01 93.5,50.12
  Bottom 0.305: v80.96,52.39 81.28,52.07 91.56,52.07 91.61,52.01 | 51.62,53.5 57.31,53.5 v58.1,54.29 | v58.42,58.1 61.91,54.61 70.17,54.61 72.39,52.39 v76.83,52.39 | B6.HV1 96.72,45.2 94.54,45.2 93.5,46.24 93.5,50.12
A7_LV  (via drill 0.35)
  Top 0.3: 80.5,24.88 80.5,35.75 84.25,39.5 85.88,39.5 88.88,42.5 89.12,42.5 B6.LV1
  Top 0.305: 80.5,24.88 80.5,21.7 v80.28,21.48
  Bottom 0.305: U$2.30 76.58,17.78 v80.28,21.48
A8
  Top 0.3: IC3.12 23.12,15.25 14.12,24.25 14.12,24.38 13.12,25.38 11.5,25.38 U$1.P$11
A9  (via drill 0.35)
  Top 0.3: v13.38,24 13.38,19.88 14.38,18.88 16.62,18.88 22.75,12.75 23.12,12.75 IC3.11
  Bottom 0.3: v13.38,24 13.38,32.62 11.88,32.62 11.5,33 U$1.P$17
A10
  Top 0.3: IC3.6 15.5,7.62 14.12,7.62 9.12,12.62 9.12,13.38 7.38,15.12 U$1.P$4
A11
  Top 0.3: 10.5,54.62 11.88,54.62 14.38,57.12 15.88,57.12 IC10.5 | 5.88,53.86 5.88,27.75 7,26.62 8,26.62 11.38,23.25 11.38,22.88 U$1.P$9
  Top 0.305: 10.5,54.62 6.68,54.62 6.03,53.98 6.03,54.02 5.88,53.86
A12
  Top 0.305: IC3.4 15.56,13.14 17.23,14.82 17.23,15.66 16.51,16.39 16.51,16.51 12.7,16.51 U$1.P$5
A13
  Top 0.305: IC3.3 13.12,15.24 11.92,16.43 8.81,16.43 U$1.P$6
A15  (via drill 0.35)
  Top 0.3: v18.25,62.62 17.25,63.62 7.88,63.62 3.66,59.41 3.66,27.46
  Top 0.305: 3.66,27.46 3.66,19.83 4.45,19.05 10.16,19.05 U$1.P$7
  Bottom 0.3: v18.25,62.62 19.88,62.62 22.38,60.12 23,60.12 23.38,59.75 IC10.11
D0  (via drill 0.35)
  Top 0.3: 10.88,44.5 7.5,47.88 7.5,48.25 U$1.P$30
  Top 0.305: 10.88,44.5 13.92,44.5 v13.97,44.45 | v17.14,44.45 17.2,44.5 17.25,44.45 19.68,44.45 21.27,46.04 IC4.2
  Bottom 0.305: v13.97,44.45 v17.14,44.45
D0_HV  (via drill 0.35)
  Top 0.3: v37.62,48.6 37.62,46.75 34.38,43.5 32.75,43.5 IC4.18 | 45.12,60.75 46.38,60.75 52.62,67 52.62,67.75 54.38,69.5 B3.HV4 | 37.78,53.34 37.78,53.09 38.42,52.45 v38.42,51.75
  Top 0.305: 45.12,60.75 45.12,60.68 37.78,53.34
  Bottom 0.3: v37.62,48.6 37.62,49.05 38.42,49.85 v38.42,51.75
D0_LV
  Top 0.3: U$2.2 69.12,63.5 69.12,64 66.12,67 66.12,67.75 64.38,69.5 B3.LV4
D1  (via drill 0.35)
  Top 0.3: v18.21,41.93 14.43,41.93 11.88,39.38 9,39.38 7.75,38.12 7.5,38.12 U$1.P$22
  Bottom 0.3: v18.21,41.93 22.81,41.93 23.88,43 24.62,43 25,43.38 IC4.3
D1_HV
  Top 0.3: 38.88,46.82 38.88,48.25 39.26,48.62 40.19,48.62 | 46.88,52.38 46.88,55.38 52.5,61 52.5,65.12 54.25,66.88 B3.HV3
  Top 0.305: 46.88,52.38 46.88,50.47 44.4,47.99 43.01,47.99 42.99,48.01 40.81,48.01 40.19,48.62 | IC4.17 33.34,40.96 38.73,46.35 38.73,46.67 38.88,46.82
D1_LV
  Top 0.3: U$2.3/CANTX 69.12,61 69.12,61.5 66.25,64.38 66.25,65.12 64.5,66.88 B3.LV3
D2  (via drill 0.35)
  Top 0.3: v21.12,43.88 24,41 25,41 IC4.4 | 9.21,49.53 13.02,49.53 16.51,46.04 18.34,46.04 v19,45.38
  Top 0.305: U$1.P$32 7.94,50.8 9.21,49.53
  Bottom 0.3: v21.12,43.88 19.62,45.38 v19,45.38
D2_HV
  Top 0.3: 33.12,38.5 32.75,38.5 IC4.16 | 40.5,45.88 43,45.88 47.5,50.38 47.5,50.8 47.5,55.25 51.5,59.25 54.25,59.25 B3.HV2
  Top 0.305: 40.5,45.88 39.84,45.88 37.78,43.81 37.78,43.16 33.12,38.5
D2_LV
  Top 0.3: U$2.4/CANRX 69.12,58.5 65.62,58.5 64.88,59.25 64.5,59.25 B3.LV2
D3
  Top 0.3: U$1.P$26 7.52,43.18 8.71,41.99 13.26,41.99 14.45,43.18 14.61,43.18
  Top 0.305: IC4.5 24.45,38.42 19.68,43.18 14.61,43.18
D3_HV
  Top 0.3: 43.12,43 40.88,43 33.88,36 32.75,36 IC4.15 | 54.25,56.75 B3.HV1 | 51.75,55.88 51.75,49.66 50.59,48.5 47.55,48.5
  Top 0.305: 47.55,48.5 43.81,44.77 43.81,43.69 43.12,43 | 51.75,55.88 52.7,56.83 54.17,56.83 54.25,56.75
D3_LV
  Top 0.3: U$2.5 69.12,55.88 65.75,55.88 64.88,56.75 64.5,56.75 B3.LV1
D4
  Top 0.3: IC4.6 25,35.88 13.5,35.88 11.88,34.25 8.75,34.25 7.5,33 U$1.P$18
D4_HV  (via drill 0.35)
  Top 0.3: 43,40.88 41,40.88 33.5,33.38 32.75,33.38 IC4.14 | 48,45.88 50.62,45.88 52.62,47.88 52.62,49.62 54.38,51.38 B4.HV4
  Top 0.305: 43,40.88 43,40.9 43.59,41.49 43.59,42 45.72,44.13 v45.72,44.77 | 48,45.88 47.15,45.88 v46.99,45.72
  Bottom 0.305: v46.99,45.72 46.67,45.72 v45.72,44.77
D4_LV
  Top 0.3: U$2.6 69.12,53.25 66.5,53.25 64.75,51.5 64.5,51.5 B4.LV4
D5
  Bottom 0.3: IC4.7 25,33.38 24.62,33.75 24,33.75 15.88,41.88 11,41.88 10.96,41.91 9.21,41.91 8.89,42.23 8.89,44.23 7.5,45.62 U$1.P$28
D5_HV
  Top 0.3: 48.62,43.38 50.62,43.38 52.5,45.25 52.5,47 54.38,48.88 B4.HV3 | 43.18,38.1 40.64,38.1 33.5,30.96 32.87,30.96 IC4.13
  Top 0.305: 48.62,43.38 45.72,40.47 45.72,38.42 44.77,37.47 43.81,37.47 43.18,38.1
D5_LV
  Top 0.3: U$2.7 69.12,50.75 66.12,50.75 64.38,49 B4.LV3
D6
  Bottom 0.3: IC4.8 25,30.88 24.62,31.25 24,31.25 15.88,39.38 11,39.38 9.72,40.65 8.44,40.65 8.44,40.64 U$1.P$24
D6_HV
  Top 0.3: 43.38,30.25 35.05,30.25 33.05,28.25 32.75,28.25 IC4.12 | 51.62,36.25 51.62,38.5 54.38,41.25 B4.HV2
  Top 0.305: 51.62,36.25 51.62,31.46 51.56,31.39 51.56,31.24 50.48,30.16 43.46,30.16 43.38,30.25
D6_LV
  Top 0.3: U$2.8 69.12,48.25 69.12,47.75 66.12,44.75 66.12,43.12 64.38,41.38 B4.LV2
D7  (via drill 0.35)
  Top 0.3: v9.84,38.1 9.21,37.47 v9.21,35.24
  Bottom 0.3: IC4.9 25,28.38 24.62,28.75 23.88,28.75 15.79,36.83 10.16,36.83 9.84,37.15 v9.84,38.1 | U$1.P$20 7.78,35.24 v9.21,35.24
D7_HV
  Top 0.3: 49.88,29.62 39.62,29.62 35.75,25.75 32.75,25.75 IC4.11 | 52.25,30.73 52.25,36.5 54.38,38.62 B4.HV1
  Top 0.305: 49.88,29.62 50.49,29.62 50.5,29.63 51.22,29.63 52.07,30.48 52.07,30.55 52.25,30.73
D7_LV
  Top 0.3: B4.LV1 64.38,38.75 66.12,40.5 66.22,40.5 67.31,41.59 67.31,43.81 U$2.9/CS
DATA_BUS_ENABLE
  Top 0.3: B2.HV2 53.88,23.25 53.75,23.38 41.16,23.38 40.32,22.54 40.32,17.14 40.01,16.83 IC1.4
DATA_BUS_ENABLE_LV  (via drill 0.35)
  Top 0.305: v65.88,32.33 68.53,32.33 U$2.24
  Bottom 0.3: v65.88,32.33 65.88,24.77 65.72,24.77 B2.LV2
FLIPFLOP_CLR  (via drill 0.35)
  Top 0.305: B2.HV1 56.52,20.64 57.78,21.91 57.78,52.07 55.24,54.61 53.52,54.61 v53.5,54.62
  Bottom 0.3: v53.5,54.62 52.25,54.62 52.25,59.5 46.38,65.38 32.38,65.38 31,64 30.5,64 30.5,62.88 IC5.1
FLIPFLOP_CLR_LV
  Bottom 0.305: U$2.25 66.99,30.48 66.67,30.16 66.67,23.18 B2.LV1
FLIPFLOP_PRE
  Top 0.3: 56.62,5.62 53.88,2.88 B1.HV1 | 40.64,68.26 48.58,68.26 52.07,71.75
  Top 0.305: 56.62,5.62 60.01,9.01 60.01,67.63 55.88,71.75 52.07,71.75 | IC5.4 38.1,65.72 40.64,68.26
FLIPFLOP_PRE_LV
  Top 0.3: B1.LV1 64.25,2.75 67.63,6.13 67.63,18.73 U$2.29
GND
  Bottom 0.305: B6.GND1 B6.GND2
  pour Top: 0,73.66 0.32,-0.32 103.19,0.32 103.19,73.03
INTERRUPT  (via drill 0.35)
  Top 0.3: 31,60.75 33,62.75 IC5.2 | 51.88,7.5 53.88,5.5 B1.HV2 | 30.13,60.75 29.21,60.75 | 29.21,60.75 27.52,60.75 26.99,61.28 24.64,61.28 24.57,61.22 22.41,61.22 22.35,61.28 19.68,61.28 18.1,59.69 IC10.4 | v33.38,54.25 33.34,54.29 33.34,55.88 33.26,55.96 32.21,55.96 29.21,58.96 29.21,60.75 | 51.12,8.26 51.12,21.91
  Top 0.305: 51.88,7.5 51.87,7.5 51.12,8.26 | 51.12,21.91 v50.92,22.11 | v50.8,28.89 v50.8,25.72 | 31,60.75 30.13,60.75 | v34.62,48.08 34.62,45.38 v34.88,45.12 | v45.4,33.97 v47.31,32.07
  Bottom 0.3: v33.38,54.25 32.38,54.25 32,53.88 32,50.38 34.12,50.38 | 43,37.88 43,37.9 42.55,38.36 40.83,38.36 40.24,38.95 40.24,39.06 36.65,42.64 36.57,42.64 36.14,43.07 36.14,43.86 v34.88,45.12
  Bottom 0.305: v50.8,28.89 49.53,30.16 IC2.11 47.62,31.75 v47.31,32.07 | v50.92,22.11 50.92,25.59 v50.8,25.72 | 34.12,50.38 34.12,50.33 34.61,49.85 34.61,48.09 v34.62,48.08 | 43,37.88 43,37.84 43.59,37.25 43.59,35.79 v45.4,33.97
INTERRUPT_LV
  Top 0.3: U$2.28 69.12,22.75 69.12,22.38 66.5,19.75 66.5,7.88 64.12,5.5 B1.LV2
N$1
  Top 0.3: U$2.AREF 82,63.5 84.5,66 U$2.3V3_LO
N$2  (via drill 0.35)
  Top 0.3: v19.88,51 23.38,54.5 IC10.9
  Top 0.305: v4.76,49.21 v4.76,29.53
  Bottom 0.3: 10.88,49.5 11.88,49.5 11.9,49.53 17.14,49.53 17.46,49.85 17.78,49.85 18.73,50.8 19.68,50.8 v19.88,51
  Bottom 0.305: v4.76,49.21 5.05,49.5 10.88,49.5 | v4.76,29.53 4.76,24.13 6.03,22.86 U$1.P$10
N$3  (via drill 0.35)
  Top 0.3: v22.75,27.5 22.75,33.12 24.38,34.75 26.12,34.75 27.82,36.44 v27.82,43.66 | v29.5,47.25 29.5,49 v29.75,49.25
  Top 0.305: IC10.10 24.14,56.51 24.96,56.51 26.13,55.33 26.13,53.58 27.63,52.08 28.22,52.08 v28.23,52.09
  Bottom 0.3: v22.75,27.5 15.62,20.38 IC3.1 | v27.82,43.66 28.39,44.23 29.21,44.23 30.43,45.45 30.43,46.32 v29.5,47.25 | v29.75,49.25 29.75,51.53 29.18,52.09 v28.23,52.09
N$4  (via drill 0.35)
  Top 0.3: v30.75,41.25 30.62,41.38 30.62,45 28.76,46.86
  Top 0.305: 28.76,46.86 28.7,46.86 27.94,47.62 27.94,49.11 v27.8,49.25
  Bottom 0.3: v30.75,41.25 27.86,41.25 27.86,25.36 26.38,23.88 22.25,23.88 16.62,18.25 16,18.25 15.62,17.88 IC3.2 | 25.05,52 23.5,52 IC10.8
  Bottom 0.305: v27.8,49.25 25.05,52
N$5
  Top 0.3: R1.1 86.88,66.88 86.88,66.38 84.5,64 84.5,63.5 U$2.23/A9
N$6
  Top 0.3: R2.1 86.88,62.12 85.62,62.12 84.5,61 U$2.22/A8
N$7  (via drill 0.35)
  Top 0.305: v4.45,7.62 1.59,10.48 1.59,60.33 v4.13,62.87
  Bottom 0.3: 14.38,9.12 18.5,9.12 22.12,5.5 22.75,5.5 23.12,5.12 IC3.8 | 4.25,62.88 13.38,62.88 14,62.25 15.88,62.25 IC10.3
  Bottom 0.305: 14.38,9.12 5.95,9.12 v4.45,7.62 | v4.13,62.87 4.24,62.87 4.25,62.88
N$8  (via drill 0.35)
  Top 0.305: v2.54,57.15 2.54,12.7 4.45,10.79 v9.21,10.79
  Bottom 0.3: 8,57.25 10.62,57.25 10.75,57.12 11.88,57.12 14.38,54.62 15.88,54.62 IC10.6 | IC3.5 14.92,10.79 v9.21,10.79
  Bottom 0.305: 8,57.25 7.98,57.25 7.96,57.23 3.89,57.23 v2.54,57.15
N$9
  Top 0.3: R3.1 90.75,64.38 84.88,58.5 84.5,58.5 U$2.21/A7
N$10
  Bottom 0.3: R1.2 89.27,69.53 RGB_LED1.1
N$11  (via drill 0.35)
  Top 0.3: v29.25,43.5 v29.25,38.62
  Bottom 0.3: v29.25,38.62 29.25,18.75 35.38,12.62 35.88,12.62 36.75,11.75 IC1.6 | v29.25,43.5 31.75,46 32.62,46 IC4.19
N$12
  Top 0.3: IC9.1 48.5,4.25 48.5,4.62 45.38,7.75 35.62,7.75 31.62,11.75 31.62,13.12 31.5,13.25 C9.+ | S1.3 100,48.25 100,44.38 101.12,43.25 101.12,10
  Top 0.305: 101.12,10 100.01,8.89 96.2,8.89 95.25,7.94 95.25,2.22 94.61,1.59 64.7,1.59 64.67,1.56 51.14,1.56 IC9.1
N$13  (via drill 0.35)
  Top 0.3: IC1.3 34.29,19.37 34.29,14.29 IC1.5
  Top 0.305: v39.76,43.69 39.76,43.57 35.56,39.37 v35.13,39.37 v35.12,39.38 | v38.5,57 38.5,56.28 35.56,53.34 35.56,51.84 v35.52,51.8
  Bottom 0.3: 38.5,58.33 v38.5,57 | v35.12,39.38 35.12,25.75 35,25.75 34.38,25.12 34.38,20.25 35.25,20.25 36.12,19.38 IC1.3
  Bottom 0.305: v39.76,43.69 39.76,43.74 37.78,45.72 36.78,45.72 35.35,47.15 35.35,51.63 v35.52,51.8 | IC5.3 35.56,61.28 36.83,60.01 36.83,60 38.5,58.33
N$14
  Top 0.3: R2.2 87,64.88 89.75,67.62 90.75,67.62 RGB_LED1.2
N$15
  Top 0.3: R3.2 93.38,64.5 93.38,67.38 93.5,67.5 RGB_LED1.4
N$16  (via drill 0.35)
  Top 0.305: U$2.20/A6 89.01,51.32 91.26,51.32 92.26,50.32 92.26,46.2 92.25,46.19 92.25,45.55 93.03,44.77 93.03,10.79 91.61,9.38 v90.62,9.38
  Bottom 0.3: v90.62,9.38 88.5,9.38 88.25,9.62 85.88,9.62 84.88,8.62 R4.1
N$17
  Top 0.3: 91.94,42.56 91.94,11.82 89.88,9.75 88.75,9.75 88.5,10 87.25,10 86.25,9 86.25,7.75 84.88,6.38 R5.1 | 86,48.5 86,51.75 84.5,53.25 U$2.19/A5/SCL
  Top 0.305: 91.94,42.56 91.94,43.95 91.12,44.77 89.73,44.77 86,48.5
N$18  (via drill 0.35)
  Top 0.3: v73,21.89 73,16.12 84.75,4.38 84.75,3.5 R6.1 | 73.5,39.88 84.38,50.75 U$2.18/A4/SDA
  Top 0.305: 73.5,39.88 73.5,29.37 74.93,27.94 74.93,27.03 v75.41,26.56
  Bottom 0.305: v73,21.89 v73.01,21.89 75.56,24.45 75.56,26.4 v75.41,26.56
N$19
  Top 0.3: R4.2 87.38,8.5 91.75,8.5 92.38,7.88 RGB_LED2.1
N$20
  Top 0.3: R5.2 87.38,6.38 90.38,6.38 RGB_LED2.2
N$21
  Top 0.3: R6.2 87.38,3.5 90.38,3.5 RGB_LED2.4
N$22
  Top 0.3: S1.2 95.25,49 89.5,54.75 89.5,57.12 J1.3
RD_
  Top 0.3: 31.88,24.12 36.5,24.12 36.75,24.38 IC1.1 | IC4.1 25.12,48.5 25.38,48.5 30,43.88 30,24.22 | 24,24.25 23.88,24.25 17.75,30.38 11.5,30.38 U$1.P$15
  Top 0.305: 30.1,24.12 31.88,24.12 | 30.1,24.12 24.12,24.12 24,24.25 | 30,24.22 30.1,24.12
  Bottom 0.3: 46.07,20.88 41.12,20.88 38,24 37.25,24 36.88,24.38 IC1.1 | 51.38,15.62 53.88,15.62 B1.HV4
  Bottom 0.305: 51.38,15.62 50.1,15.62 48.26,17.46 48.26,18.1 46.35,20 46.35,20.59 46.07,20.88
RD_LV_  (via drill 0.35)
  Top 0.3: v65.12,19.25 65.12,16.88 64.25,16 64.25,15.62 B1.LV4
  Bottom 0.305: v65.12,19.25 65.12,19.8 65.43,20.1 65.43,21.21 67.18,22.97 67.18,27.5 67.63,27.94 U$2.26
VCC
  pour Bottom: 0,73.66 103.5,73.66 103.82,0 0,0
VCC/2
  Top 0.3: B6.LV 89.25,37.38 91,35.62 91,20.88 89.25,19.12 B5.LV 89.12,19 87.38,19 85,16.62 83.12,16.62 74.38,25.38 U$2.3V3_2 74.25,25.5 73.75,25.5 72.38,26.88 71.02,26.88 70.64,26.5 65.12,26.5 64.25,25.62 B2.LV 62.38,25.72 | B1.LV 64.12,8 62.38,9.75 62.38,25.72 | B3.LV 64.38,61.88 62.75,60.25 62.75,45.25 62.38,44.88 62.38,43.81 | B4.LV 62.38,43.81 | 62.38,43.81 62.38,25.72
WAIT_
  Top 0.3: 43.12,62.75 IC5.6 | U$1.P$33 11.5,53.38 11.75,53.38 14.38,56 24.75,56 25.62,55.12 25.62,53.38 27.62,51.38 27.68,51.38 27.93,51.13 31.51,51.13 31.75,51.38
  Top 0.305: 43.12,62.75 34.61,54.23 34.61,53.66 33.97,53.02 33.97,51.75 33.59,51.38 31.75,51.38
WR_  (via drill 0.35)
  Top 0.3: U$1.P$13 11.5,27.88 14.25,27.88 20.12,22 36.75,22 IC1.2
  Top 0.305: v47.62,14.61 v49.85,12.38
  Bottom 0.3: 45.5,17.88 41.5,17.88 37.88,21.5 37.25,21.5 36.88,21.88 IC1.2 | 50.38,13 53.88,13 B1.HV3
  Bottom 0.305: 45.5,17.88 | v47.62,14.61 46.13,16.1 46.13,17.25 45.5,17.88 | 50.38,13 50.38,12.91 v49.85,12.38
WR_LV_
  Top 0.3: U$2.27 69.12,25.38 69.12,24.88 65.88,21.62 65.88,14.88 64.12,13.12 B1.LV3

### Text on the board
tNames: TRS-80 / SS Drive / V2.0